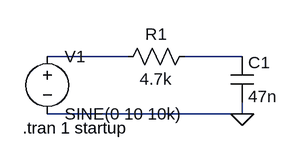
[diagram p0: schematic low_pass_filter.asc]
low_pass_filter.asc, the LTspice schematic file:
Version 4
SHEET 1 880 680
WIRE 96 160 -16 160
WIRE 256 160 176 160
WIRE 256 240 256 224
WIRE 256 240 -16 240
FLAG 256 240 0
SYMBOL cap 240 160 R0
SYMATTR InstName C1
SYMATTR Value 47n
SYMATTR SpiceLine V=25 Irms=100
SYMBOL res 192 144 R90
WINDOW 0 0 56 VBottom 2
WINDOW 3 32 56 VTop 2
SYMATTR InstName R1
SYMATTR Value 4.7k
SYMATTR SpiceLine tol=1 pwr=100
SYMBOL voltage -16 144 R0
WINDOW 123 0 0 Left 2
WINDOW 39 0 0 Left 2
SYMATTR InstName V1
SYMATTR Value SINE(0 10 10k)
TEXT -50 260 Left 2 !.tran 1 startup

The netlist it stands for:
* low_pass_filter.asc
C1 N002 0 47n V=25 Irms=100
R1 N002 N001 4.7k tol=1 pwr=100
V1 N001 0 SINE(0 10 10k)
.tran 1 startup
.backanno
.end